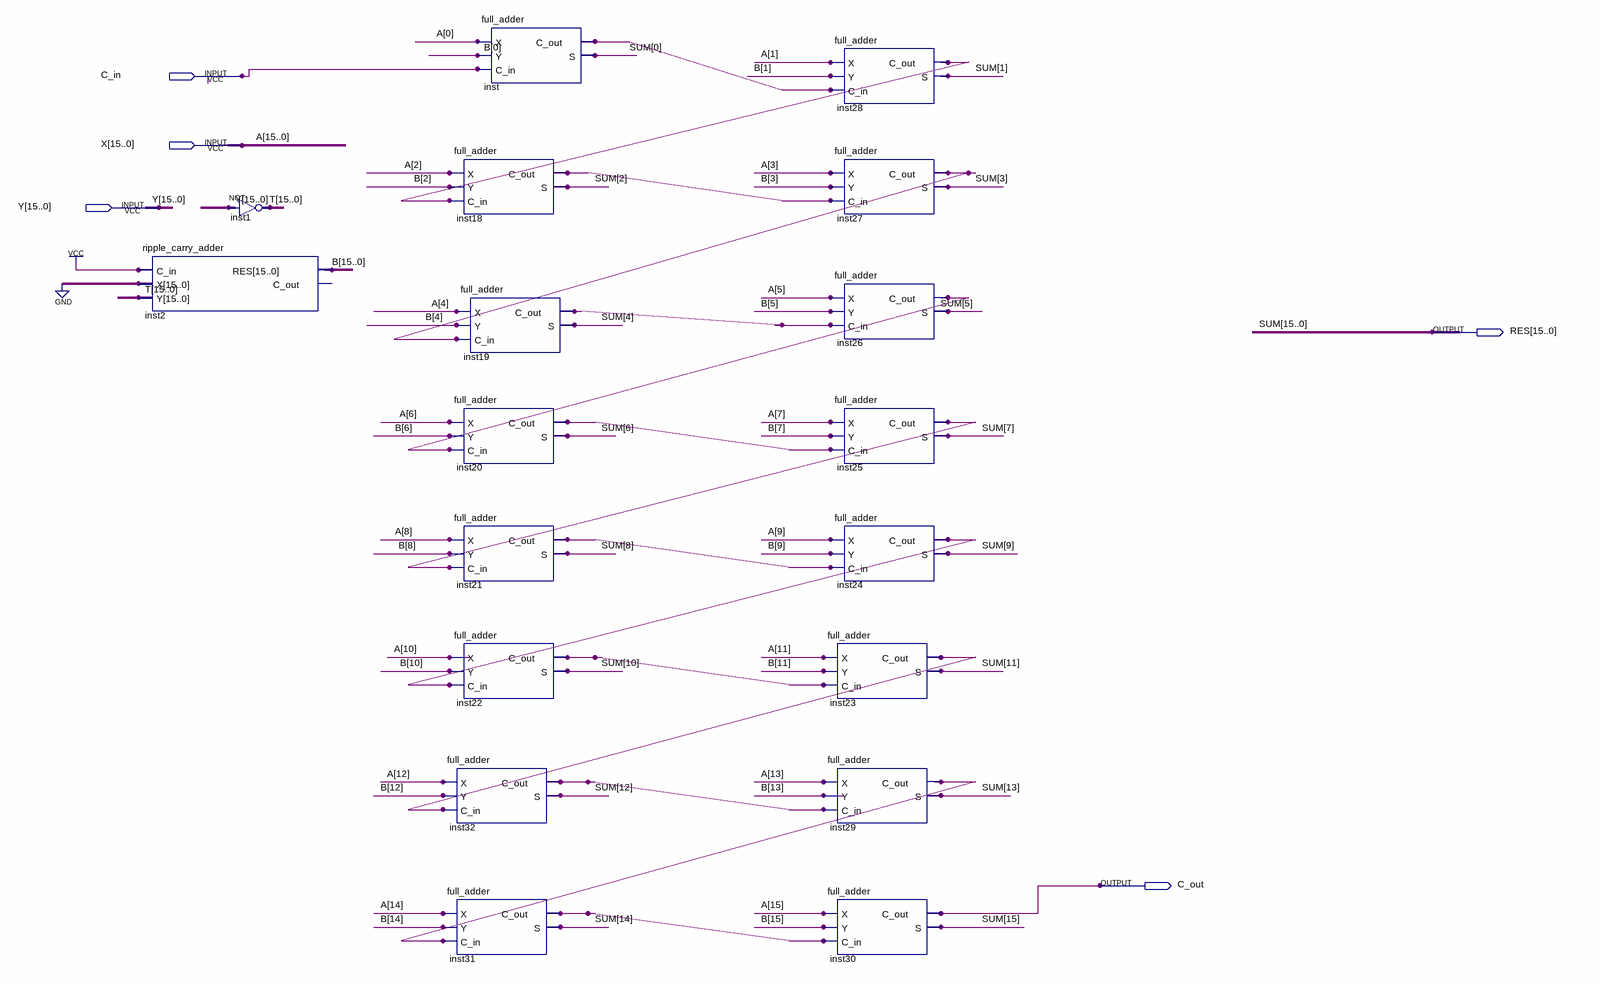
[diagram p0: schematic sheet]
// Quartus schematic minus.bdf as structural Verilog: 18 symbols, 5 pins
module minus (
  input  C_in,
  input  [15:0] X,
  input  [15:0] Y,
  output [15:0] RES,
  output C_out
);

  wire inst18_c_out, inst19_c_out, inst20_c_out, inst21_c_out, inst22_c_out, inst23_c_out, inst24_c_out,
       inst25_c_out, inst26_c_out, inst27_c_out, inst28_c_out, inst29_c_out, inst31_c_out, inst32_c_out,
       inst_c_out;
  wire [15:0] B, T;

  ripple_carry_adder inst2 (.C_in(1'b1), .X({16{1'b0}}), .Y(T), .RES(B));  // open: C_out
  assign T = ~Y;  // NOT inst1, 16 bits wide
  full_adder inst18 (.X(X[2]), .Y(B[2]), .C_in(inst28_c_out), .C_out(inst18_c_out), .S(RES[2]));
  full_adder inst19 (.X(X[4]), .Y(B[4]), .C_in(inst27_c_out), .C_out(inst19_c_out), .S(RES[4]));
  full_adder inst20 (.X(X[6]), .Y(B[6]), .C_in(inst26_c_out), .C_out(inst20_c_out), .S(RES[6]));
  full_adder inst21 (.X(X[8]), .Y(B[8]), .C_in(inst25_c_out), .C_out(inst21_c_out), .S(RES[8]));
  full_adder inst22 (.X(X[10]), .Y(B[10]), .C_in(inst24_c_out), .C_out(inst22_c_out), .S(RES[10]));
  full_adder inst32 (.X(X[12]), .Y(B[12]), .C_in(inst23_c_out), .C_out(inst32_c_out), .S(RES[12]));
  full_adder inst31 (.X(X[14]), .Y(B[14]), .C_in(inst29_c_out), .C_out(inst31_c_out), .S(RES[14]));
  full_adder inst (.X(X[0]), .Y(B[0]), .C_in(C_in), .C_out(inst_c_out), .S(RES[0]));
  full_adder inst28 (.X(X[1]), .Y(B[1]), .C_in(inst_c_out), .C_out(inst28_c_out), .S(RES[1]));
  full_adder inst27 (.X(X[3]), .Y(B[3]), .C_in(inst18_c_out), .C_out(inst27_c_out), .S(RES[3]));
  full_adder inst26 (.X(X[5]), .Y(B[5]), .C_in(inst19_c_out), .C_out(inst26_c_out), .S(RES[5]));
  full_adder inst25 (.X(X[7]), .Y(B[7]), .C_in(inst20_c_out), .C_out(inst25_c_out), .S(RES[7]));
  full_adder inst24 (.X(X[9]), .Y(B[9]), .C_in(inst21_c_out), .C_out(inst24_c_out), .S(RES[9]));
  full_adder inst23 (.X(X[11]), .Y(B[11]), .C_in(inst22_c_out), .C_out(inst23_c_out), .S(RES[11]));
  full_adder inst29 (.X(X[13]), .Y(B[13]), .C_in(inst32_c_out), .C_out(inst29_c_out), .S(RES[13]));
  full_adder inst30 (.X(X[15]), .Y(B[15]), .C_in(inst31_c_out), .C_out(C_out), .S(RES[15]));

  // Other names for the same wires on the sheet: SUM[15:0] = RES; A[15:0] = X
endmodule
